# EAGLE design TempSetUP_V2 - PrototypeAdjusted v4 (EAGLE 9.7.0)
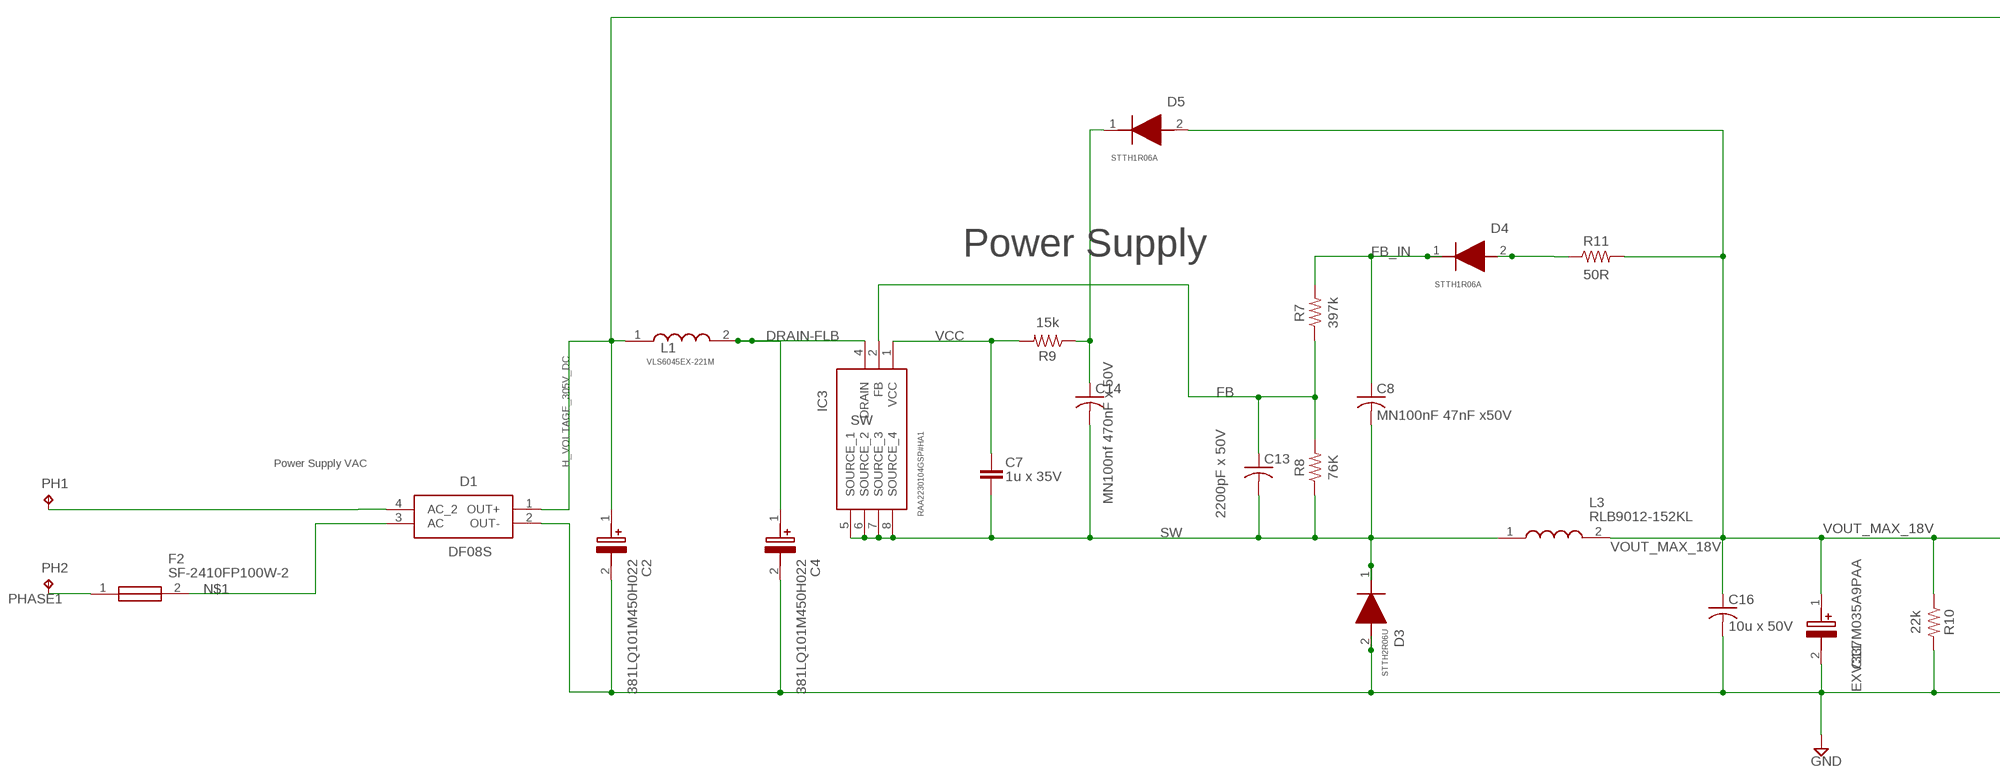
[diagram p0: schematic, sheet 1, part 1 of 2]
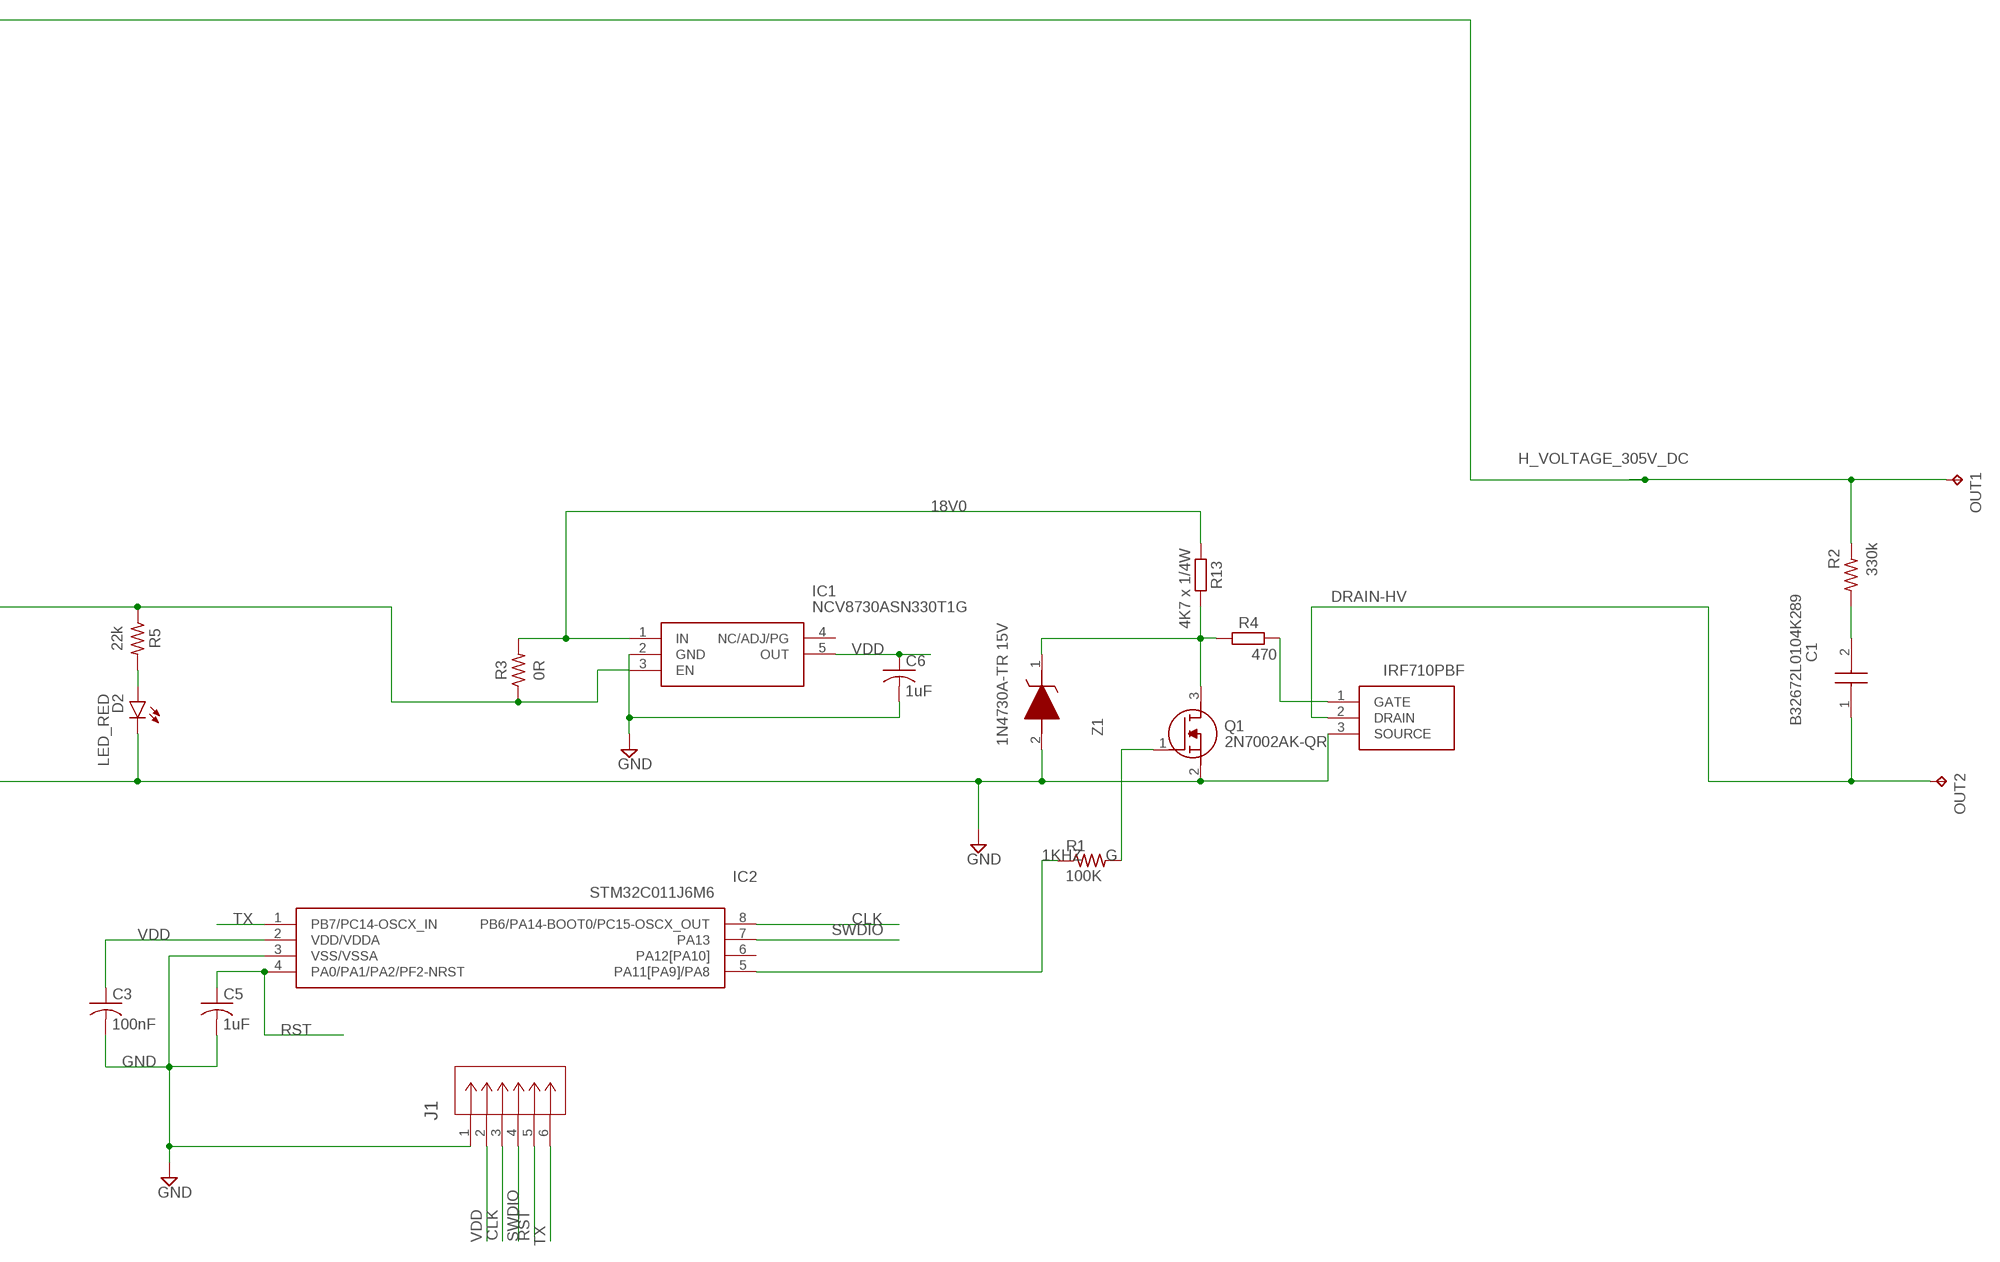
[diagram p1: schematic, sheet 1, part 2 of 2]

## Parts
C1  B32672L0104K289  [B32672_(18_X_9)]
C2  381LQ101M450H022  [381LQ101M450H022]
C3  100nF  C-US_CHIP-0805(2012-METRIC)  [CAPC2012X110]
C4  381LQ101M450H022  [381LQ101M450H022]
C5  1uF  C-US_CHIP-0805(2012-METRIC)  [CAPC2012X110]
C6  1uF  C-US_CHIP-0805(2012-METRIC)  [CAPC2012X110]
C7  1u x 35V  CAPACITORC0805K  [C0805K]
C8  MN100nF 47nF x50V  C-US_CHIP-0805(2012-METRIC)  [CAPC2012X110]
C11  EXV337M035A9PAA  [CAPAE1030X1050N]
C13  2200pF x 50V  C-US_CHIP-0805(2012-METRIC)  [CAPC2012X110]
C14  MN100nf 470nF x 50V  C-US_CHIP-0805(2012-METRIC)  [CAPC2012X110]
C16  10u x 50V  C-US_CHIP-0805(2012-METRIC)  [CAPC2012X110]
D1  DF08S  [SOT508P985X260-4N]
D2  LED_RED  LED_RADIAL_RED  [LEDRD254W60D565H860B]
D3  STTH2R06U  [DIOM5436X265N]
D4  STTH1R06A  [DIOM5126X265N]
D5  STTH1R06A  [DIOM5126X265N]
F2  SF-2410FP100W-2  [SF2410FP100W2]
IC1  NCV8730ASN330T1G  NCV8730ASN500T1G  [SOT95P275X110-5N]
IC2  STM32C011J6M6  [SOIC127P600X175-8N]
IC3  RAA2230104GSP#HA1  [RAA2230104GSPHA1]
J1  530470610CON_530470610_MOL  [CON_530470610_MOL]
L1  VLS6045EX-221M  [VLS6045]
L3  RLB9012-152KL  [RLB9012152KL]
OUT1  TPPAD1-13  [P1-13]
OUT2  TPPAD1-13  [P1-13]
PH1  TPPAD1-17  [P1-17]
PH2  TPPAD1-17  [P1-17]
Q1  2N7002AK-QR  [SOT95P230X110-3N]
Q2  IRF710PBF  [TO254P465X1024X2050-3P]
R1  100K  R-US_CHIP-0805(2012-METRIC)  [RESC2012X65]
R2  330k  R-US_AXIAL-7.2MM-PITCH  [RESAD724W46L381D178B]
R3  0R  R-US_CHIP-0805(2012-METRIC)  [RESC2012X65]
R4  470  R_CHIP-0805(2012-METRIC)  [RESC2012X65]
R5  22k  R-US_CHIP-0805(2012-METRIC)  [RESC2012X65]
R7  397k  R-US_CHIP-0805(2012-METRIC)  [RESC2012X65]
R8  76K  R-US_CHIP-0805(2012-METRIC)  [RESC2012X65]
R9  15k  R-US_CHIP-0805(2012-METRIC)  [RESC2012X65]
R10  22k  R-US_CHIP-0805(2012-METRIC)  [RESC2012X65]
R11  50R  R-US_CHIP-0805(2012-METRIC)  [RESC2012X65]
R13  4K7 x 1/4W  R_CHIP-0805(2012-METRIC)  [RESC2012X65]
Z1  1N4730A-TR 15V  1N4730A-TR  [DIOAD1310W86L370D235]

## Nets
1KHZ: IC2.5(PA11[PA9]/PA8) R1.1
18V0: IC1.1(IN) R3.2 R13.1
CLK: IC2.8(PB6/PA14-BOOT0/PC15-OSCX_OUT) J1.3
DRAIN-FLB: C4.1(+) IC3.4(DRAIN) L1.2
DRAIN-HV: C1.1 OUT2.TP Q2.2(DRAIN)
FB: C13.1 IC3.2(FB) R7.1 R8.2
FB_IN: C8.1 D4.1(K) R7.2
G: Q1.1(G) R1.2
GND: C2.2(-) C3.2 C4.2(-) C5.2 C6.2 C11.2(-) C16.2 D1.2(OUT-) D2.2(C) D3.2(A) IC1.2(GND) IC2.3(VSS/VSSA) J1.1 Q1.2(S) Q2.3(SOURCE) R10.2 Z1.2(A)
H_VOLTAGE_305V_DC [AC_Supply]: C2.1(+) D1.1(OUT+) L1.1 OUT1.TP R2.2
N$1 [AC_Supply]: D1.3(AC) F2.2
N$2: D4.2(A) R11.1
N$3: C14.1 D5.1(K) R9.1
N$4: D1.4(AC_2) PH1.TP
N$5: C1.2 R2.1
N$7: Q1.3(D) R4.1 R13.2 Z1.1(K)
N$8: Q2.1(GATE) R4.2
N$10: D2.1(A) R5.2
PHASE1 [AC_Supply]: F2.1 PH2.TP
RST: C5.1 IC2.4(PA0/PA1/PA2/PF2-NRST) J1.5
SW: C7.2 C8.2 C13.2 C14.2 D3.1(K) IC3.5(SOURCE_1) IC3.6(SOURCE_2) IC3.7(SOURCE_3) IC3.8(SOURCE_4) L3.1 R8.1
SWDIO: IC2.7(PA13) J1.4
TX: IC2.1(PB7/PC14-OSCX_IN) J1.6
VCC: C7.1 IC3.1(VCC) R9.2
VDD: C3.1 C6.1 IC1.5(OUT) IC2.2(VDD/VDDA) J1.2
VOUT_MAX_18V: C11.1(+) C16.1 D5.2(A) IC1.3(EN) L3.2 R3.1 R5.1 R10.1 R11.2
Unconnected: IC1.4(NC/ADJ/PG) IC2.6(PA12[PA10])

## Notes on the sheet
- Power Supply
- Power Supply VAC

## Library data of the parts
C1 = B32672L0104K289:B32672L0104K289: Metallized Polypropylene Capacitors (MKP/MFP), 0.1uF, 1000V DC, 9mm(W) x 17.5mm(H) x 18mm(L) Source: Datasheet <https://product.tdk.com/system/files/dam/doc/product/capacitor/film/mkp_mfp/data_sheet/20/20/db/fc_2009/mkp_b32671l_672l.pdf>; DESCRIPTION: Metallized Polypropylene Capacitors (MKP/MFP), 0.1uF, 1000V DC, 9mm(W) x 17.5mm(H) x 18mm(L); HEIGHT: 17.5mm; MANUFACTURER_NAME: TDK; MANUFACTURER_PART_NUMBER: B32672L0104K289; MOUSER_PART_NUMBER: 871-B32672L104K289; MOUSER_PRICE-STOCK: https://www.mouser.co.uk/ProductDetail/EPCOS-TDK/B32672L0104K289?qs=xhbEVWpZdWdhIiaSPmotTw%3D%3D
C2 C4 = 381LQ101M450H022:381LQ101M450H022: Cap Aluminum Lytic 100uF 450V 20% (22 X 30mm) Snap-In 10mm 1.824 Ohm 640mA 2000h 105C Source: Datasheet <https://www.cde.com/resources/catalogs/381LQ.pdf>; DESCRIPTION: Cap Aluminum Lytic 100uF 450V 20% (22 X 30mm) Snap-In 10mm 1.824 Ohm 640mA 2000h 105C; HEIGHT: 32mm; MANUFACTURER_NAME: Cornell Dubilier; MANUFACTURER_PART_NUMBER: 381LQ101M450H022; MOUSER_PART_NUMBER: 5985-381-450V100; MOUSER_PRICE-STOCK: https://www.mouser.co.uk/ProductDetail/Cornell-Dubilier-CDE/381LQ101M450H022?qs=CL13mIxpkeHWkG3PFOUJSw%3D%3D
C3 C5 C6 C8 C13 C14 C16 = Capacitor:C-US: Capacitor - ANSI; CATEGORY: Capacitor
C7 = Fidget_Spinner:CAPACITOR: CAPACITOR, European symbol; SPICEPREFIX: C
C11 = EXV337M035A9PAA:EXV337M035A9PAA: EXV, Aluminum, Aluminum Electrolytic, 330 uF, 20%, 35 VDC, -55/+105C, 105C, -55C, 105C, 5,000 Hrs, 12 % , 120 mOhms, 0.595, 115.5 uA, 2, 3, 10mm, 10.2mm, 500 Source: Datasheet <https://content.kemet.com/datasheets/KEM_A4003_EXV.pdf>; DESCRIPTION: EXV, Aluminum, Aluminum Electrolytic, 330 uF, 20%, 35 VDC, -55/+105C, 105C, -55C, 105C, 5,000 Hrs, 12 % , 120 mOhms, 0.595, 115.5 uA, 2, 3, 10mm, 10.2mm, 500; HEIGHT: 10.5mm; MANUFACTURER_NAME: KEMET; MANUFACTURER_PART_NUMBER: EXV337M035A9PAA; MOUSER_PART_NUMBER: 80-EXV337M035A9PAA; MOUSER_PRICE-STOCK: https://www.mouser.co.uk/ProductDetail/KEMET/EXV337M035A9PAA?qs=E9QF1UCAUX5WvfTaafpwOA%3D%3D
D1 = DF08S:DF08S: DF08S, Bridge Rectifier Single Phase, 1.5A 800V, 4-Pin SDIP Source: Datasheet <http://componentsearchengine.com/Datasheets/1/DF08S.pdf>; DESCRIPTION: DF08S, Bridge Rectifier Single Phase, 1.5A 800V, 4-Pin SDIP; HEIGHT: mm; MANUFACTURER_NAME: onsemi; MANUFACTURER_PART_NUMBER: DF08S; MOUSER_PART_NUMBER: 512-DF08S; MOUSER_PRICE-STOCK: https://www.mouser.co.uk/ProductDetail/onsemi-Fairchild/DF08S?qs=Ec0VQc59F%252BlRA0XgpNiCJg%3D%3D
D2 = Tinkercad:LED_RADIAL: LED - Generic; CATEGORY: Opto-Electronic; SUB-CATEGORY: LED
D3 = STTH2R06U:STTH2R06U: Rectifiers RECTIFIER Source: Datasheet <https://componentsearchengine.com/Datasheets/2/STTH2R06U.pdf>; DESCRIPTION: Rectifiers RECTIFIER; HEIGHT: 2.65mm; MANUFACTURER_NAME: STMicroelectronics; MANUFACTURER_PART_NUMBER: STTH2R06U; MOUSER_PART_NUMBER: 511-STTH2R06U; MOUSER_PRICE-STOCK: https://www.mouser.co.uk/ProductDetail/STMicroelectronics/STTH2R06U?qs=kndcJBrKlnSKjLhtarou4A%3D%3D
D4 D5 = STTH1R06A:STTH1R06A: STTH1R06A, Fast Rectifier Diode, Switching 1A max, 600V 45ns, 2-Pin, SMA Source: Datasheet <http://www.st.com/web/en/resource/technical/document/datasheet/CD00005135.pdf>; DESCRIPTION: STTH1R06A, Fast Rectifier Diode, Switching 1A max, 600V 45ns, 2-Pin, SMA; HEIGHT: 2.65mm; MANUFACTURER_NAME: STMicroelectronics; MANUFACTURER_PART_NUMBER: STTH1R06A; MOUSER_PART_NUMBER: 511-STTH1R06A; MOUSER_PRICE-STOCK: https://www.mouser.co.uk/ProductDetail/STMicroelectronics/STTH1R06A?qs=kndcJBrKlnTzl3o%252BhwomPg%3D%3D
F2 = SF-2410FP100W-2:SF-2410FP100W-2: Surface Mount Fuses 1.0A Fast Acting 2410 SinglFuse Source: Datasheet <https://componentsearchengine.com/Datasheets/1/SF-2410FP100W-2.pdf>; DESCRIPTION: Surface Mount Fuses 1.0A Fast Acting 2410 SinglFuse; HEIGHT: 2.36mm; MANUFACTURER_NAME: Bourns; MANUFACTURER_PART_NUMBER: SF-2410FP100W-2; MOUSER_PART_NUMBER: 652-SF-2410FP100W-2; MOUSER_PRICE-STOCK: https://www.mouser.co.uk/ProductDetail/Bourns/SF-2410FP100W-2?qs=55YtniHzbhBKO2quK4sgow%3D%3D
IC1 = NCV8730ASN500T1G:NCV8730ASN500T1G: LDO Voltage Regulators NCV8730 TSOP-5 5V0 Source: Datasheet <https://www.arrow.com/en/products/ncv8730asn500t1g/on-semiconductor>; ARROW_PART_NUMBER: NCV8730ASN330T1G; ARROW_PRICE-STOCK: https://www.arrow.com/en/products/ncv8730asn500t1g/on-semiconductor?region=nac; DESCRIPTION: LDO Voltage Regulators NCV8730 TSOP-5 5V0; HEIGHT: 1.1mm; MANUFACTURER_NAME: onsemi; MANUFACTURER_PART_NUMBER: NCV8730ASN330T1G; MOUSER_PART_NUMBER: NCV8730ASN330T1G; MOUSER_PRICE-STOCK: https://www.mouser.co.uk/ProductDetail/onsemi/NCV8730ASN500T1G?qs=GedFDFLaBXHk1ABQHGw1TA%3D%3D
IC2 = STM32C011J6M6:STM32C011J6M6: Mainstream Arm Cortex-M0+ MCU with 32 Kbytes of Flash memory, 6 Kbytes RAM, 48 MHz CPU, 2x USART, timers, ADC, comm. I/F, 2-3.6V Source: Datasheet <https://www.st.com/resource/en/datasheet/stm32c011d6.pdf>; DESCRIPTION: Mainstream Arm Cortex-M0+ MCU with 32 Kbytes of Flash memory, 6 Kbytes RAM, 48 MHz CPU, 2x USART, timers, ADC, comm. I/F, 2-3.6V; HEIGHT: 1.75mm; MANUFACTURER_NAME: STMicroelectronics; MANUFACTURER_PART_NUMBER: STM32C011J6M6; MOUSER_PART_NUMBER: 511-STM32C011J6M6; MOUSER_PRICE-STOCK: https://www.mouser.co.uk/ProductDetail/STMicroelectronics/STM32C011J6M6?qs=IPgv5n7u5Qas2LaNYHG%2FbQ%3D%3D
IC3 = RAA2230104GSP#HA1:RAA2230104GSP#HA1: The RAA223010 is a universal input AC/DC switching buck regulator with ultra-low standby power that features a 700V integrated MOSFET capable of delivering 10W output power. It supports output voltage as low as 3.3V.The RAA223010 combines constant off-time control for heavy load and Pulse Frequency Modulation (PFM) for light-load operation. Constant off-time controls switching frequency above the audible frequency around 45kHz. PFM eliminates any potential noises while offering superior light-load efficienc Source: Datasheet <https://www.renesas.com/us/en/products/power-power-management/acdc-isolated-dcdc-converters/non-isolated-acdc-buck-converters/raa223010-700v-acdc-regulator-ultra-low-standby-power-and-6w-output-power>; DESCRIPTION: The RAA223010 is a universal input AC/DC switching buck regulator with ultra-low standby power that features a 700V integrated MOSFET capable of delivering 10W output power. It supports output voltage as low as 3.3V.The RAA223010 combines constant off-time control for heavy load and Pulse Frequency Modulation (PFM) for light-load operation. Constant off-time controls switching frequency above the audible frequency around 45kHz. PFM eliminates any potential noises while offering superior light-load efficienc; HEIGHT: 1.75mm; MANUFACTURER_NAME: Renesas Electronics; MANUFACTURER_PART_NUMBER: RAA2230104GSP#HA1
J1 = Library:530470610; COPYRIGHT: Copyright (C) 2024 Ultra Librarian. All rights reserved.; MANUFACTURER_PART_NUMBER: 530470610; MFR_NAME: Molex Connector Corporation
L1 = VLS6045EX-221M:VLS6045EX-221M: Wirewound Inductor 220uH 500mA 1.15 mOhm TDK VLS-EX Series Shielded Wire-wound SMD Inductor with a Ferrite Core, 220 uH Wire-Wound 500mA Idc Source: Datasheet <https://product.tdk.com/system/files/dam/doc/product/inductor/inductor/smd/catalog/inductor_commercial_power_vls6045ex_en.pdf>; DESCRIPTION: Wirewound Inductor 220uH 500mA 1.15 mOhm TDK VLS-EX Series Shielded Wire-wound SMD Inductor with a Ferrite Core, 220 uH Wire-Wound 500mA Idc; HEIGHT: mm; MANUFACTURER_NAME: TDK; MANUFACTURER_PART_NUMBER: VLS6045EX-221M; MOUSER_PART_NUMBER: 810-VLS6045EX-221M; MOUSER_PRICE-STOCK: https://www.mouser.co.uk/ProductDetail/TDK/VLS6045EX-221M?qs=oF%2FSscNnLpA3oz6m5MznZA%3D%3D
L3 = RLB9012-152KL:RLB9012-152KL: 1.5 mH Unshielded Drum Core, Wirewound Inductor 430 mA 3.8 Ohm max. Radial, Vertical Cylinder Source: Datasheet <https://www.bourns.com/docs/Product-Datasheets/RLB9012.pdf>; DESCRIPTION: 1.5 mH Unshielded Drum Core, Wirewound Inductor 430 mA 3.8 Ohm max. Radial, Vertical Cylinder; HEIGHT: 12.2mm; MANUFACTURER_NAME: Bourns; MANUFACTURER_PART_NUMBER: RLB9012-152KL; MOUSER_PART_NUMBER: 652-RLB9012-152KL; MOUSER_PRICE-STOCK: https://www.mouser.co.uk/ProductDetail/Bourns/RLB9012-152KL?qs=dB0LedT%252BmmDtmDJXzMqqfA%3D%3D
OUT1 OUT2 PH1 PH2 = testpad:TP: Test pad
Q1 = 2N7002AK-QR:2N7002AK-QR: N-Channel 60 V 240mA 320mW Surface Mount SOT-23-3 (TO-236) Source: Datasheet <https://assets.nexperia.com/documents/data-sheet/2N7002AK-Q.pdf>; DESCRIPTION: N-Channel 60 V 240mA 320mW Surface Mount SOT-23-3 (TO-236); HEIGHT: 1.1mm; MANUFACTURER_NAME: Nexperia; MANUFACTURER_PART_NUMBER: 2N7002AK-QR; MOUSER_PART_NUMBER: 771-2N7002AK-QR; MOUSER_PRICE-STOCK: https://www.mouser.co.uk/ProductDetail/Nexperia/2N7002AK-QR?qs=mELouGlnn3ff0hT2G%252Bqyfw%3D%3D
Q2 = IRF710PBF:IRF710PBF: N-Channel 400V 2A (Tc) 36W (Tc) Through Hole TO-220 Source: Datasheet <http://www.vishay.com/docs/91041/91041.pdf>; DESCRIPTION: N-Channel 400V 2A (Tc) 36W (Tc) Through Hole TO-220; HEIGHT: 4.65mm; MANUFACTURER_NAME: Vishay; MANUFACTURER_PART_NUMBER: IRF710PBF; MOUSER_PART_NUMBER: 844-IRF710PBF; MOUSER_PRICE-STOCK: https://www.mouser.co.uk/ProductDetail/Vishay-Semiconductors/IRF710PBF?qs=cvaI6Thkwxuk0gB7iIUQ%252Bg%3D%3D
R1 = Tutorial - Fusion 360:R-US: Resistor Fixed - ANSI; CATEGORY: Resistor; SUB-CATEGORY: Fixed
R2 R3 R5 R7-R11 = Resistor:R-US: Resistor Fixed - ANSI; CATEGORY: Resistor; SUB-CATEGORY: Fixed
R4 R13 = Resistor:R: Resistor Fixed - Generic; CATEGORY: Resistor; SUB-CATEGORY: Fixed
Z1 = 1N4730A-TR:1N4730A-TR: Vishay, 3.9V Zener Diode 5% 1.3 W Through Hole 2-Pin DO-41 Source: Datasheet; DESCRIPTION: Vishay, 3.9V Zener Diode 5% 1.3 W Through Hole 2-Pin DO-41; HEIGHT: mm; MANUFACTURER_NAME: Vishay; MANUFACTURER_PART_NUMBER: 1N4730A-TR; MOUSER_PART_NUMBER: 78-1N4730A; MOUSER_PRICE-STOCK: https://www.mouser.co.uk/ProductDetail/Vishay-Semiconductors/1N4730A-TR?qs=8Acm1RElxHKg6qEmelBmWw%3D%3D

## Net classes
1 AC_Supply: width 0.381 mm, clearance 0.762 mm

## Board
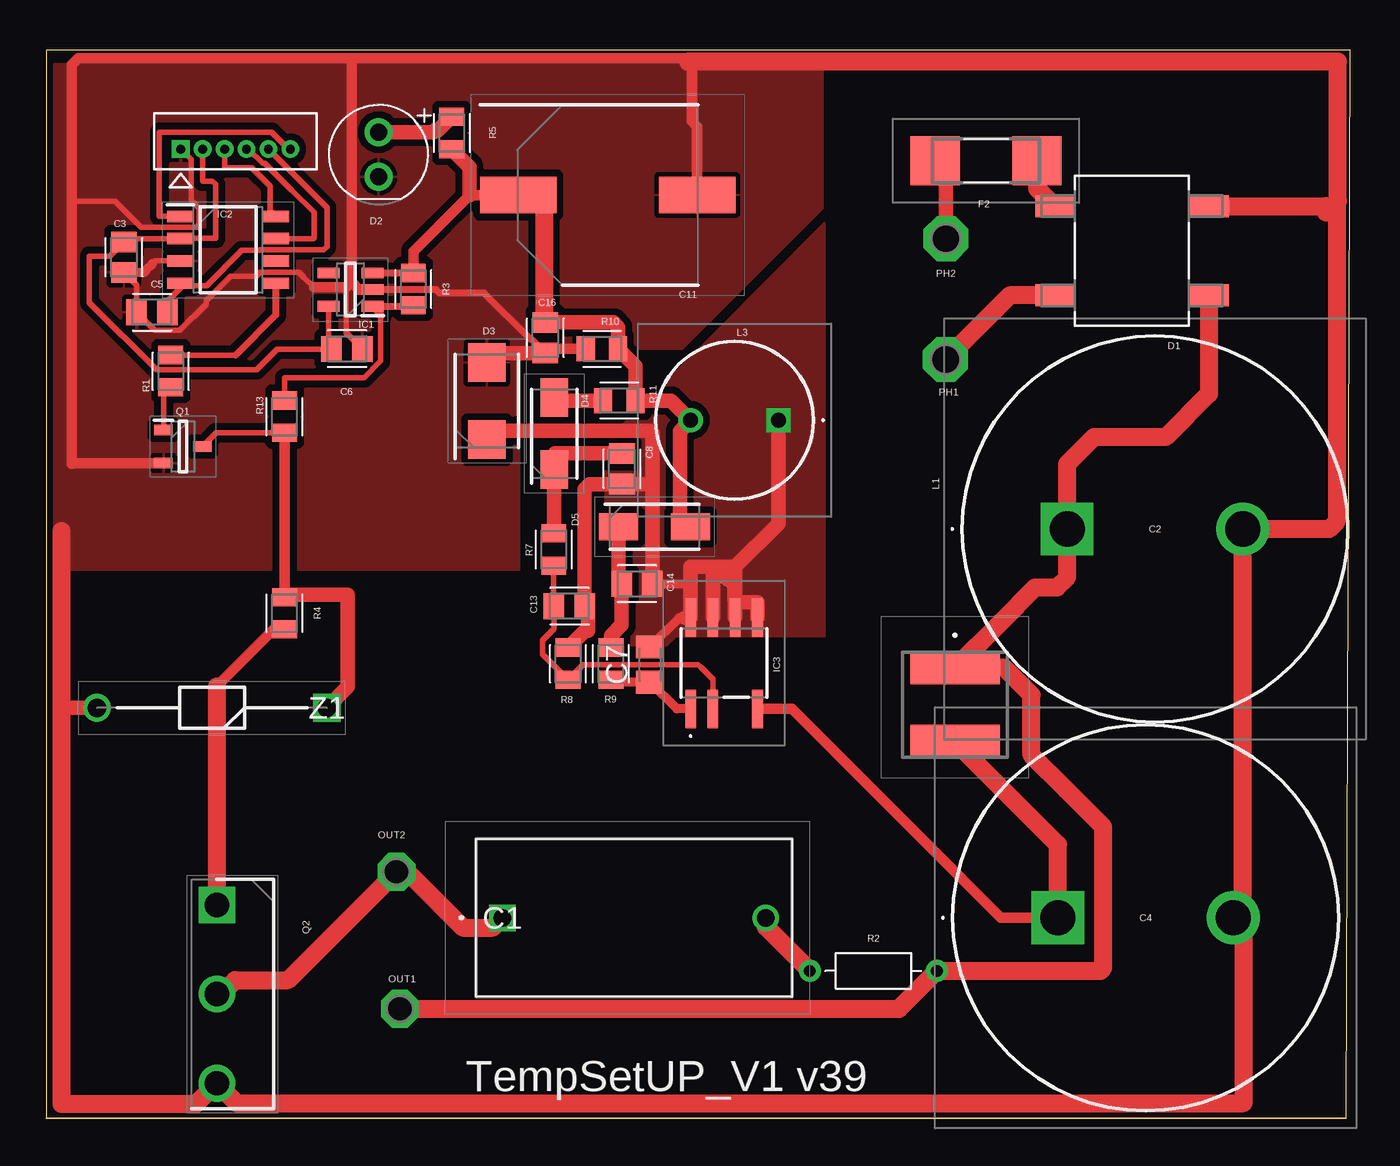
[diagram p2: board, top side]

Size 74.31 x 60.83 mm. Coordinates in mm from the lower left corner, seen from the top.
Outline: 74.11,0 74.31,60.83 0,60.83 0,0 74.11,0
Copper layers (1*16): Top / Bottom
Stack-up Default Layer Stack: Top User Defined 0.035mm / Dielectric-1 User Defined 1.5mm / Bottom User Defined 0.035mm
Design rules: minimum copper width class=1 15mil, minimum copper width 6mil, minimum drill size 0.35mm, copper clearance class=1 to class=1 30mil, copper clearance wire_polygon to wire_polygon 6mil, copper clearance wire_polygon to pad_smd 6mil, copper clearance wire_polygon to via 6mil, copper clearance pad_smd to pad_smd 6mil, copper clearance pad_smd to via 6mil, copper clearance via to via 6mil, copper clearance smd to pad (same net) 6mil, copper clearance smd to via (same net) 6mil, copper clearance smd to smd (same net) 6mil, dimension clearance 6mil, via restrict clearance 0mil, restrict clearance 0mil, drill distance 6mil, keepout clearance 0mil

### Footprints (pad centres in the part's own frame; a part is rotated, then mirrored left to right if it is on the bottom)
B32672_(18_X_9) = drill 1 pad 1.5 square: 1 0,0 | drill 1 pad 1.5: 2 15,0
381LQ101M450H022 = drill 2 pad 3 square: 1 0,0 | drill 2 pad 3: 2 10,0
CAPC2012X110 = smd 1.165 x 1.465: 1 -0.875,0; 2 0.875,0
C0805K = smd 1.3 x 1.6: 1 -1,0; 2 1,0
CAPAE1030X1050N = smd 4.35 x 2.1: 1 -5.1,0; 2 5.1,0
SOT508P985X260-4N = smd 2.235 x 1.245: 1 -4.394,2.54; 2 -4.394,-2.54; 3 4.394,-2.54; 4 4.394,2.54
LEDRD254W60D565H860B = drill 0.981 pad 1.581: 1 -1.27,0; 2 1.27,0
DIOM5436X265N = smd 2.2 x 2.15: 1 -2.2,0; 2 2.2,0
DIOM5126X265N = smd 2.2 x 1.55: 1 -2.05,0; 2 2.05,0
SF2410FP100W2 = smd 2.8 x 2.8: 1 -2.9,0; 2 2.9,0
SOT95P275X110-5N = smd 1.25 x 0.6: 1 -1.25,0.95; 2 -1.25,0; 3 -1.25,-0.95; 4 1.25,-0.95; 5 1.25,0.95
SOIC127P600X175-8N = smd 1.525 x 0.65: 1 -2.712,1.905; 2 -2.712,0.635; 3 -2.712,-0.635; 4 -2.712,-1.905; 5 2.712,-1.905; 6 2.712,-0.635; 7 2.712,0.635; 8 2.712,1.905
RAA2230104GSPHA1 = smd 2.2 x 0.6: 1 -2.6,1.905; 2 -2.6,0.635; 4 -2.6,-1.905; 5 2.6,-1.905; 6 2.6,-0.635; 7 2.6,0.635; 8 2.6,1.905
CON_530470610_MOL = drill 0.5 pad 0.85 square: 1 0,0 | drill 0.5 pad 0.85: 2 -1.25,0; 3 -2.5,0; 4 -3.75,0; 5 -5,0; 6 -6.25,0
VLS6045 = smd 1.9 x 5.1: 1 -2.1,0; 2 2.1,0
RLB9012152KL = drill 0.85 pad 1.381 square: 1 0,0 | drill 0.85 pad 1.381: 2 5,0
P1-13 = drill 1.321 pad 2.159 octagon: TP 0,0
P1-17 = drill 1.702 pad 2.54 octagon: TP 0,0
SOT95P230X110-3N = smd 1.05 x 0.6: 1 -1.1,0.95; 2 -1.1,-0.95; 3 1.1,0
TO254P465X1024X2050-3P = drill 1.39 pad 2.085 square: 1 -2.54,0 | drill 1.39 pad 2.085: 2 2.54,0; 3 7.62,0
RESC2012X65 = smd 1.031 x 1.42: 1 -0.919,0; 2 0.919,0
RESAD724W46L381D178B = drill 0.66 pad 1.26: 1 -3.62,0; 2 3.62,0
DIOAD1310W86L370D235 = drill 1.05 pad 1.575 square: 1 0,0 | drill 1.05 pad 1.575: 2 13.1,0

### Placement (x,y rotation side)
C1  26.01,11.4 0 top
C2  58.19,33.55 0 top
C3  4.44,49.03 270 top
C4  57.66,11.4 0 top
C5  6.04,45.91 180 top
C6  17.14,43.81 0 top
C7  34.42,25.83 90 top
C8  32.82,36.98 270 top
C11  32,52.58 0 top
C13  29.82,29.16 0 top
C14  33.68,30.43 0 top
C16  28.45,44.45 270 top
D1  61.87,49.4 180 top
D2  18.95,54.89 270 top
D3  25.12,40.84 90 top
D4  28.96,38.99 90 top
D5  34.67,33.68 0 top
F2  53.56,54.53 0 top
IC1  17.35,47.19 180 top
IC2  10.37,49.46 0 top
IC3  38.63,25.91 90 top
J1  7.67,55.19 180 top
L1  51.79,23.55 270 top
L3  41.73,39.75 180 top
OUT1  20.16,6.22 0 top
OUT2  19.96,14.02 0 top
PH1  51.26,43.21 0 top
PH2  51.28,50.1 0 top
Q1  7.8,38.25 0 top
Q2  9.73,9.6 270 top
R1  7.11,42.55 270 top
R2  47.14,8.38 0 top
R3  20.93,47.22 270 top
R4  13.59,28.75 270 top
R5  23.11,56.11 90 top
R7  28.93,32.38 90 top
R8  29.74,25.88 270 top
R9  32.18,25.88 270 top
R10  31.67,43.81 180 top
R11  32.66,40.87 0 top
R13  13.59,39.95 270 top
Z1  16,23.37 180 top

### Tracks (layer width: path | path; a pad name or v marks a point on that pad's centre or on a via)
1KHZ
  Top 0.305: 10.8,43.47 R1.1
  Top 0.406: IC2.5 13.09,45.75 10.8,43.47
18V0
  Top 0.305: R13.1 13.59,42.16 18.11,42.16 19.07,43.12 19.07,45.64
  Top 0.406: 19.07,45.64 19.07,45.77 IC1.1 20.87,46.24 R3.2
CLK
  Top 0.305: IC2.8 12.78,51.67 12.78,53.07 11.72,54.13 10.17,54.13 J1.3
DRAIN-FLB
  Top 0.61: C4.1 54.4,11.4 42.49,23.31 IC3.4
  Top 1.016: C4.1 57.66,15.58 L1.2
DRAIN-HV
  Top 1.016: Q2.2 9.98,7.06 10.77,7.85 13.79,7.85 OUT2.TP 20.57,14.02 23.75,10.85 25.45,10.85 C1.1
FB
  Top 0.305: R7.1 28.93,29.17 C13.1 28.94,27.88 28.3,27.23 28.3,26.41 R8.2 30.61,25.83 31.77,25.83 33.35,25.83 37.16,25.83 37.31,25.68 38,24.99 IC3.2
FB_IN
  Top 0.813: C8.1 29,37.86 D4.1 28.96,33.33 R7.2
G
  Top 0.305: R1.2 6.7,41.21 Q1.1
GND
  Top 0.305: C3.2 5.16,47.44 C5.2 6.2,44.87 7.62,44.87 9.12,46.37 9.12,46.56 10.52,47.95 11.3,47.95 11.97,47.95 12.2,48.18 14.4,48.18 14.71,47.88 15.27,47.32 | IC2.3 6.23,48.82 6.07,48.67 | C6.2 17.09,44.74 17.09,47.32 | J1.1 8.26,54.61 8.26,52.4 8.26,52.29 8.73,51.81 8.73,50.91 8.66,50.84 8.66,50.75 8.57,50.75 8.55,50.73 6.77,50.73 6.76,50.75 5.99,50.75 5.41,50.75 3.94,52.22 1.65,52.22 1.45,52.02
  Top 0.406: IC1.2 22.23,47.19 22.4,47.02 22.42,47 24.96,47 27.57,44.39 27.64,44.39 C16.2
  Top 0.508: 6.07,48.67 5.69,48.28 5.56,48.16 C3.2
  Top 0.61: C16.2 28.39,43.81 R10.2 | 17.4,60.38 30.35,60.38 36.37,60.38 36.4,60.35 36.6,60.15 36.8,59.94 36.8,56.77 37.1,56.47 C11.2 | 72.95,51.59 73,51.64 | Q1.2 1.49,37.3 1.45,37.26 1.45,37.59 1.45,51.33 1.45,52.02 1.45,59.99 1.83,60.38 17.4,60.38 | IC1.2 17.83,47.19 17.4,47.62 | 17.4,60.38 17.4,58.9 | 17.4,58.9 17.4,47.62 | 17.4,47.62 17.09,47.32 15.27,47.32 | 17.4,60.38 17.4,58.9
  Top 0.813: C16.2 25.65,43.58 D3.2 | Z1.2 1.02,23.37 0.89,23.24
  Top 1.016: D1.2 72.95,51.94 72.95,51.59 | 73,51.64 73.55,52.18 | 73.55,52.18 73.61,52.25 73.61,60.17 36.63,60.17 36.6,60.15 | 73.55,52.18 73.55,33.98 73.12,33.55 C2.2 68.19,11.94 C4.2 68.25,10.81 68.25,0.85 10.86,0.85 Q2.3 8.53,0.79 0.89,0.79 0.89,23.24 0.89,33.43
  pour Top (isolate 0.406): 0.3,60.09 0.3,31.83 0.97,31.17 27,31.17 27,60.23
  pour Top (isolate 0.406): 23.19,60.1 44.3,60.1 44.3,51.79 36.27,43.76 22.99,43.76
H_VOLTAGE_305V_DC
  Top 1.016: D1.1 66.27,41.25 63.8,38.79 59.72,38.79 58.19,37.26 C2.1 58.19,30.81 57.61,30.23 56.37,30.23 54.4,28.25 L1.1 54.62,25.65 56.16,24.11 56.16,20.68 58.14,18.69 60.25,16.59 60.25,8.53 60.1,8.38 R2.2 48.6,6.22 OUT1.TP
N$1
  Top 1.016: F2.2 56.46,52.96 D1.3
N$2
  Top 0.813: R11.1 29.14,40.86 D4.2
N$3
  Top 0.813: R9.1 32.18,27.47 32.8,28.09 C14.1 32.62,30.61 D5.1
N$4
  Top 1.016: D1.4 54.91,46.86 PH1.TP
N$5
  Top 1.016: R2.1 41.01,10.89 C1.2
N$7
  Top 0.305: Q1.3 9.68,39.03 R13.2
  Top 0.61: R13.2 R4.1
  Top 0.813: Z1.1 17.2,24.56 17.2,29.79 13.71,29.79 R4.1
N$8
  Top 0.61: R4.2 12.97,27.83 9.73,24.59
  Top 1.016: 9.73,24.59 Q2.1
N$10
  Top 0.813: R5.2 22.35,56.26 22.17,56.26 22.07,56.16 D2.1
PHASE1
  Top 0.813: F2.1 51.28,53.91 PH2.TP
RST
  Top 0.305: J1.5 16,51.86 16,49.63 15.82,49.45 12.2,49.45 12.17,49.43 11.15,49.43 9.14,47.42 7.79,47.42 | 7.79,47.42 IC2.4 | C5.1 6.91,46.54 7.79,47.42
SW
  Top 0.508: C7.2 36.09,28.51 36.42,28.51 | C14.2 36.63,30.43 36.73,30.53
  Top 0.813: 37.67,31.39 36.8,31.39 36.73,31.39 36.73,30.53 IC3.8 36.42,28.51 | 39.27,31.39 37.67,31.39 | 37.67,31.39 38,31.19 | 38,31.19 39.22,30.43 39.22,29.57 39.4,29.39 40.54,29.39 IC3.5 | IC3.7 38,31.19 | IC3.6 39.27,31.39 | C14.2 34.56,32.64 34.56,36.11 | 34.56,36.11 34.56,36.85 34.56,39.01 34.42,39.15 25.63,39.15 D3.1 | 34.56,36.11 C8.2 30.98,36.11 30.68,35.81 30.7,35.8 C13.2 30.87,28.98 30.87,27.76 30.7,27.76 R8.1 | L3.1 41.73,33.86 39.27,31.39
  pour Top (isolate 0.406, no thermals): 31.83,26.88 31.83,38.51 44.4,51.08 44.4,27.39 35.92,27.39 35.41,26.88
SWDIO
  Top 0.305: IC2.7 15.22,50.09 15.27,50.14 15.27,51.59 13.99,52.86 12.75,54.1 12.47,54.38 12.34,54.38 11.53,55.19 J1.4
TX
  Top 0.305: IC2.1 6.45,51.36 6.45,56.16 12.85,56.16 13.81,55.19 J1.6
VCC
  Top 0.508: IC3.1 35.94,23.31 C7.1 32.31,24.83 R9.2
VDD
  Top 0.305: J1.2 8.92,53.37 9.47,53.37 9.65,53.19 9.68,53.16 9.68,50.12 7.69,50.12 IC2.2 5.27,50.09 4.62,50.09 C3.1 3.63,49.1 2.46,49.1 2.46,46.46 6.3,42.62 11.99,42.62 13.16,43.79 16.24,43.79 C6.1 16.1,43.99 IC1.5
VOUT_MAX_18V
  Top 0.406: IC1.3 R3.1
  Top 0.61: C11.1 24.13,52.58 22.5,50.95 20.93,49.38 R3.1
  Top 0.813: D5.2 36.11,34.29 36.11,38.48 36.11,39.13 L3.2 35.62,40.87 R11.2 33.58,42.82 R10.1 32.59,45.05 32.46,45.19 32.32,45.33 C16.1 | R5.1 24.13,54.17 24.13,52.58
  Top 1.016: C11.1 28.21,52.58 28.37,52.41 28.37,45.4 C16.1

### Text on the board
SilkscreenTop: TempSetUP_V1 v39